# Altium schematic sheet schema.SchDoc
size A3; SheetNumber: 1; SheetTotal: 1
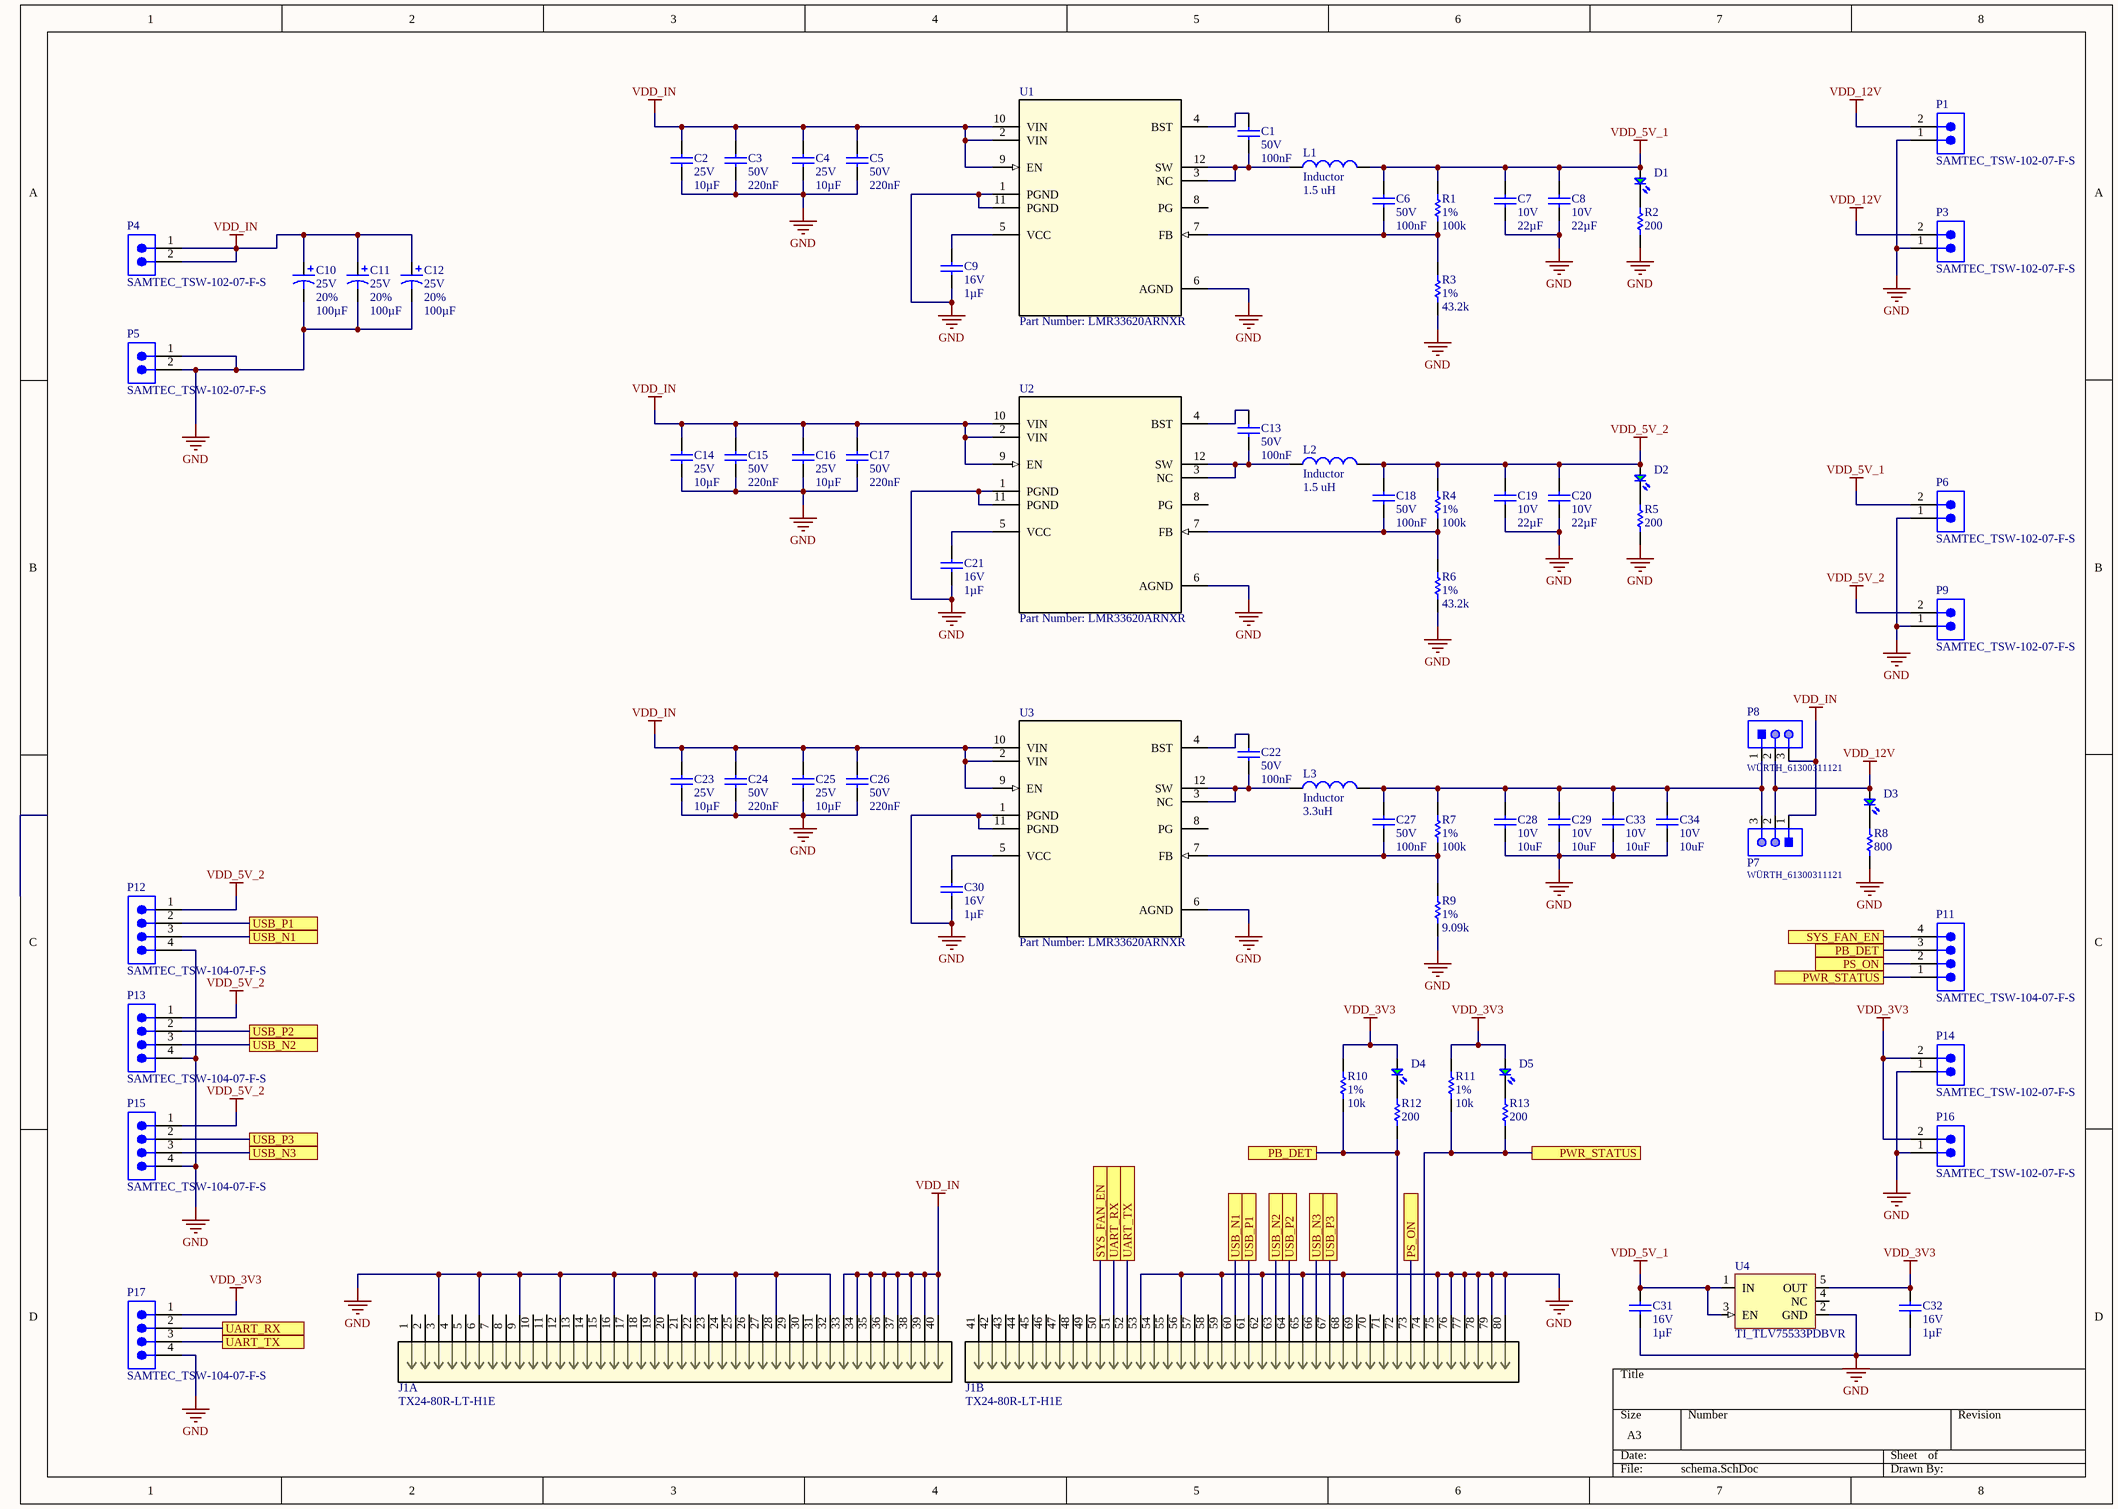
[diagram p0: schema.SchDoc]

## Parts
C1  Voltage Rating: 50V  Component Value: 100nF  [C0402N]  (hidden comment: CAP MLCC 100nF 0402 10% 50V X5R)
C2  Voltage Rating: 25V  Component Value: 10µF  [C0805N]  (hidden comment: CAP MLCC 10uF 0805 10% 25V X5R)
C3  Voltage Rating: 50V  Component Value: 220nF  [C0402N]  (hidden comment: CAP MLCC 100nF 0402 10% 50V X5R)
C4  Voltage Rating: 25V  Component Value: 10µF  [C0805N]  (hidden comment: CAP MLCC 10uF 0805 10% 25V X5R)
C5  Voltage Rating: 50V  Component Value: 220nF  [C0402N]  (hidden comment: CAP MLCC 100nF 0402 10% 50V X5R)
C6  Voltage Rating: 50V  Component Value: 100nF  [C0402N]  (hidden comment: CAP MLCC 100nF 0402 10% 50V X5R)
C7  Voltage Rating: 10V  Component Value: 22µF  [C0805N]  (hidden comment: CAP MLCC 22uF 0805 10% 10V X5R)
C8  Voltage Rating: 10V  Component Value: 22µF  [C0805N]  (hidden comment: CAP MLCC 22uF 0805 10% 10V X5R)
C9  Voltage Rating: 16V  Component Value: 1µF  [C0402N]  (hidden comment: CAP MLCC 1uF 0402 10% 16V X5R)
C10  Voltage Rating: 25V  Component Tolerance: 20%  Component Value: 100µF  [New footprint 1]  (hidden comment: ECAP 100uF radial 20% 25V 0.7mohm)
C11  Voltage Rating: 25V  Component Tolerance: 20%  Component Value: 100µF  [New footprint 1]  (hidden comment: ECAP 100uF radial 20% 25V 0.7mohm)
C12  Voltage Rating: 25V  Component Tolerance: 20%  Component Value: 100µF  [New footprint 1]  (hidden comment: ECAP 100uF radial 20% 25V 0.7mohm)
C13  Voltage Rating: 50V  Component Value: 100nF  [C0402N]  (hidden comment: CAP MLCC 100nF 0402 10% 50V X5R)
C14  Voltage Rating: 25V  Component Value: 10µF  [C0805N]  (hidden comment: CAP MLCC 10uF 0805 10% 25V X5R)
C15  Voltage Rating: 50V  Component Value: 220nF  [C0402N]  (hidden comment: CAP MLCC 100nF 0402 10% 50V X5R)
C16  Voltage Rating: 25V  Component Value: 10µF  [C0805N]  (hidden comment: CAP MLCC 10uF 0805 10% 25V X5R)
C17  Voltage Rating: 50V  Component Value: 220nF  [C0402N]  (hidden comment: CAP MLCC 100nF 0402 10% 50V X5R)
C18  Voltage Rating: 50V  Component Value: 100nF  [C0402N]  (hidden comment: CAP MLCC 100nF 0402 10% 50V X5R)
C19  Voltage Rating: 10V  Component Value: 22µF  [C0805N]  (hidden comment: CAP MLCC 22uF 0805 10% 10V X5R)
C20  Voltage Rating: 10V  Component Value: 22µF  [C0805N]  (hidden comment: CAP MLCC 22uF 0805 10% 10V X5R)
C21  Voltage Rating: 16V  Component Value: 1µF  [C0402N]  (hidden comment: CAP MLCC 1uF 0402 10% 16V X5R)
C22  Voltage Rating: 50V  Component Value: 100nF  [C0402N]  (hidden comment: CAP MLCC 100nF 0402 10% 50V X5R)
C23  Voltage Rating: 25V  Component Value: 10µF  [C0805N]  (hidden comment: CAP MLCC 10uF 0805 10% 25V X5R)
C24  Voltage Rating: 50V  Component Value: 220nF  [C0402N]  (hidden comment: CAP MLCC 100nF 0402 10% 50V X5R)
C25  Voltage Rating: 25V  Component Value: 10µF  [C0805N]  (hidden comment: CAP MLCC 10uF 0805 10% 25V X5R)
C26  Voltage Rating: 50V  Component Value: 220nF  [C0402N]  (hidden comment: CAP MLCC 100nF 0402 10% 50V X5R)
C27  Voltage Rating: 50V  Component Value: 100nF  [C0402N]  (hidden comment: CAP MLCC 100nF 0402 10% 50V X5R)
C28  Voltage Rating: 10V  Component Value: 10uF  [C0805N]  (hidden comment: CAP MLCC 22uF 0805 10% 10V X5R)
C29  Voltage Rating: 10V  Component Value: 10uF  [C0805N]  (hidden comment: CAP MLCC 22uF 0805 10% 10V X5R)
C30  Voltage Rating: 16V  Component Value: 1µF  [C0402N]  (hidden comment: CAP MLCC 1uF 0402 10% 16V X5R)
C31  Voltage Rating: 16V  Component Value: 1µF  [C0402N]  (hidden comment: CAP MLCC 1uF 0402 10% 16V X5R)
C32  Voltage Rating: 16V  Component Value: 1µF  [C0402N]  (hidden comment: CAP MLCC 1uF 0402 10% 16V X5R)
C33  Voltage Rating: 10V  Component Value: 10uF  [C0805N]  (hidden comment: CAP MLCC 22uF 0805 10% 10V X5R)
C34  Voltage Rating: 10V  Component Value: 10uF  [C0805N]  (hidden comment: CAP MLCC 22uF 0805 10% 10V X5R)
D1  Hongbright_H2214AG72E0Z01  [New footprint 1]  (value not drawn)
D2  Hongbright_H2214AG72E0Z01  [New footprint 1]  (value not drawn)
D3  Hongbright_H2214AG72E0Z01  [New footprint 1]  (value not drawn)
D4  Hongbright_H2214AG72E0Z01  [New footprint 1]  (value not drawn)
D5  Hongbright_H2214AG72E0Z01  [New footprint 1]  (value not drawn)
J1  TX24-80R-LT-H1E  [CON80_2X40_MR_TX24_JAE]  (parts A,B of 2)
L1  Inductor  value 1.5 uH  [INDC2016X10N]
L2  Inductor  value 1.5 uH  [INDC2016X10N]
L3  Inductor  value 3.3uH  [INDC2016X10N]
P1  SAMTEC_TSW-102-07-F-S  [SAMTEC-TSW-102-07-X-S]
P3  SAMTEC_TSW-102-07-F-S  [SAMTEC-TSW-102-07-X-S]
P4  SAMTEC_TSW-102-07-F-S  [SAMTEC-TSW-102-07-X-S]
P5  SAMTEC_TSW-102-07-F-S  [SAMTEC-TSW-102-07-X-S]
P6  SAMTEC_TSW-102-07-F-S  [SAMTEC-TSW-102-07-X-S]
P7  WÜRTH_61300311121  [61300311121]
P8  WÜRTH_61300311121  [61300311121]
P9  SAMTEC_TSW-102-07-F-S  [SAMTEC-TSW-102-07-X-S]
P11  SAMTEC_TSW-104-07-F-S  [SAMTEC-TSW-104-07-X-S]
P12  SAMTEC_TSW-104-07-F-S  [SAMTEC-TSW-104-07-X-S]
P13  SAMTEC_TSW-104-07-F-S  [SAMTEC-TSW-104-07-X-S]
P14  SAMTEC_TSW-102-07-F-S  [SAMTEC-TSW-102-07-X-S]
P15  SAMTEC_TSW-104-07-F-S  [SAMTEC-TSW-104-07-X-S]
P16  SAMTEC_TSW-102-07-F-S  [SAMTEC-TSW-102-07-X-S]
P17  SAMTEC_TSW-104-07-F-S  [SAMTEC-TSW-104-07-X-S]
R1  Component Tolerance: 1%  Component Value: 100k  [R0402N]  (hidden comment: RES 100k 0402 1% 63mW)
R2  Component Value: 200  [R0402N]  (hidden comment: RES 100k 0402 1% 63mW)
R3  Component Tolerance: 1%  Component Value: 43.2k  [R0402N]  (hidden comment: RES 100k 0402 1% 63mW)
R4  Component Tolerance: 1%  Component Value: 100k  [R0402N]  (hidden comment: RES 100k 0402 1% 63mW)
R5  Component Value: 200  [R0402N]  (hidden comment: RES 100k 0402 1% 63mW)
R6  Component Tolerance: 1%  Component Value: 43.2k  [R0402N]  (hidden comment: RES 100k 0402 1% 63mW)
R7  Component Tolerance: 1%  Component Value: 100k  [R0402N]  (hidden comment: RES 100k 0402 1% 63mW)
R8  Component Value: 800  [R0402N]  (hidden comment: RES 100k 0402 1% 63mW)
R9  Component Tolerance: 1%  Component Value: 9.09k  [R0402N]  (hidden comment: RES 100k 0402 1% 63mW)
R10  Component Tolerance: 1%  Component Value: 10k  [R0402N]  (hidden comment: RES 100k 0402 1% 63mW)
R11  Component Tolerance: 1%  Component Value: 10k  [R0402N]  (hidden comment: RES 100k 0402 1% 63mW)
R12  Component Value: 200  [R0402N]  (hidden comment: RES 100k 0402 1% 63mW)
R13  Component Value: 200  [R0402N]  (hidden comment: RES 100k 0402 1% 63mW)
U1  Part Number: LMR33620ARNXR  [RNX12]
U2  Part Number: LMR33620ARNXR  [RNX12]
U3  Part Number: LMR33620ARNXR  [RNX12]
U4  TI_TLV75533PDBVR  [SOT23-5P95_280X145L45X40N]

## Ports
PB_DET, PS_ON, PWR_STATUS, SYS_FAN_EN, UART_RX, UART_TX, USB_N1, USB_N2, USB_N3, USB_P1, USB_P2, USB_P3

## Nets
GND: C2.1 C3.1 C4.1 C5.1 C7.1 C8.1 C9.1 C10.2 C11.2 C12.2 C14.1 C15.1 C16.1 C17.1 C19.1 C20.1 C21.1 C23.1 C24.1 C25.1 C26.1 C28.1 C29.1 C30.1 C31.1 C32.1 C33.1 C34.1 J1.3 J1.6 J1.9 J1.12 J1.16 J1.19 J1.22 J1.25 J1.28 J1.32 J1.53 J1.56 J1.59 J1.62 J1.65 J1.68 J1.75 J1.76 J1.77 J1.78 J1.79 J1.80 P1.1 P3.1 P5.1 P5.2 P6.1 P9.1 P12.4 P13.4 P14.1 P15.4 P16.1 P17.4 R2.1 R3.1 R5.1 R6.1 R8.1 R9.1 U1.1(PGND) U1.6(AGND) U1.11(PGND) U2.1(PGND) U2.6(AGND) U2.11(PGND) U3.1(PGND) U3.6(AGND) U3.11(PGND) U4.2(GND)
VDD_3V3: C32.2 D4.1(+) D5.1(+) P14.2 P16.2 P17.1 R10.2 R11.2 U4.5(OUT)
VDD_5V_1: C6.2 C7.2 C8.2 C31.2 D1.1(+) L1.2 P6.2 R1.2 U4.1(IN) U4.3(EN)
VDD_5V_2: C18.2 C19.2 C20.2 D2.1(+) L2.2 P9.2 P12.1 P13.1 P15.1 R4.2
VDD_12V: D3.1(+) P1.2 P3.2 P7.2 P8.2
VDD_IN: C2.2 C3.2 C4.2 C5.2 C10.1 C11.1 C12.1 C14.2 C15.2 C16.2 C17.2 C23.2 C24.2 C25.2 C26.2 J1.33 J1.34 J1.35 J1.36 J1.37 J1.38 J1.39 J1.40 P4.1 P4.2 P7.1 P8.3 U1.2(VIN) U1.9(EN) U1.10(VIN) U2.2(VIN) U2.9(EN) U2.10(VIN) U3.2(VIN) U3.9(EN) U3.10(VIN)
PB_DET: J1.72 P11.3 R10.1 R12.1 ; port PB_DET
PS_ON: J1.73 P11.2 ; port PS_ON
PWR_STATUS: J1.74 P11.1 R11.1 R13.1 ; port PWR_STATUS
SYS_FAN_EN: J1.50 P11.4 ; port SYS_FAN_EN
UART_RX: J1.51 P17.2 ; port UART_RX
UART_TX: J1.52 P17.3 ; port UART_TX
USB_N1: J1.60 P12.3 ; port USB_N1
USB_N2: J1.63 P13.3 ; port USB_N2
USB_N3: J1.66 P15.3 ; port USB_N3
USB_P1: J1.61 P12.2 ; port USB_P1
USB_P2: J1.64 P13.2 ; port USB_P2
USB_P3: J1.67 P15.2 ; port USB_P3
NetC1_1: C1.1 L1.1 U1.3(NC) U1.12(SW)
NetC1_2: C1.2 U1.4(BST)
NetC6_1: C6.1 R1.1 R3.2 U1.7(FB)
NetC9_2: C9.2 U1.5(VCC)
NetC13_1: C13.1 L2.1 U2.3(NC) U2.12(SW)
NetC13_2: C13.2 U2.4(BST)
NetC18_1: C18.1 R4.1 R6.2 U2.7(FB)
NetC21_2: C21.2 U2.5(VCC)
NetC22_1: C22.1 L3.1 U3.3(NC) U3.12(SW)
NetC22_2: C22.2 U3.4(BST)
NetC27_1: C27.1 R7.1 R9.2 U3.7(FB)
NetC27_2: C27.2 C28.2 C29.2 C33.2 C34.2 L3.2 P7.3 P8.1 R7.2
NetC30_2: C30.2 U3.5(VCC)
NetD1_2: D1.2(-) R2.2
NetD2_2: D2.2(-) R5.2
NetD3_2: D3.2(-) R8.2
NetD4_2: D4.2(-) R12.2
NetD5_2: D5.2(-) R13.2

Not connected (* = marked no-connect by the designer): J1 1 2 4 5 7 8 10 11 13 14 15 17 18 20 21 23 24 26 27 29 30 31 41 42 43 44 45 46 47 48 49 54 55 57 58 69 70 71; U1 8(PG); U2 8(PG); U3 8(PG); U4 4(NC)

## Library data of the parts
C1 C3 C5 C6 C13 C15 C17 C18 C22 C24 C26 C27 = CMP-02799-2: Capacitor, MLCC, 100nF, 0402, 10%, 50V, X5R; TC ID: 50021748; Dielectric: X5R; Component Tolerance: 10%; Package: 0402; Operating Temperature (°C): -55 to +85
C2 C4 C14 C16 C23 C25 = CMP-02808-3: Capacitor, MLCC, 10uF, 0805, 10%, 25V, X5R; TC ID: 50016549; Dielectric: X5R; Component Tolerance: 10%; Operating Temperature (°C): -55 to +85; Package: 0805
C7 C8 C19 C20 C28 C29 C33 C34 = CMP-02864-4: Capacitor, MLCC, 22uF, 0805, 10%, 10V, X5R; TC ID: 50024017; Dielectric: X5R; Component Tolerance: 10%; Operating Temperature (°C): -55 to +85; Package: 0805
C9 C21 C30-C32 = CMP-02807-3: Capacitor, MLCC, 1uF, 0402, 10%, 16V, X5R; TC ID: 50021750; Dielectric: X5R; Component Tolerance: 10%; Operating Temperature (°C): -55 to +125; Package: 0402
C10-C12 = CMP-02868-3: Electrolytic capacitor, 100uF, radial, 20%, 25V, 0.7mohm; Manufacturer Part Number 1: 25TRV100M6.3X8; Manufacturer 1: Rubycon; TC ID: 50020370; Datasheet: http://www.rubycon.co.jp/en/catalog/e_pdfs/aluminum/e_TRV.pdf; Operating Temperature (°C): -40 to +105
D1-D5 = CMP-004-00012-6: Green LED, VFmax 3.6V; Manufacturer Part Number 1: H2214AG72E0Z01; Manufacturer 1: Hongbright; TC ID: *; Datasheet: *; Operating Temperature (°C): -40 to +100
J1 = TX24-80R-LT-H1E: No Description Available; Vendor: JAE Electronics; Built_By: EMA_UL_Team; SourceLibrary: JAE_2009-02-18; Manufacturer_Part_Number: TX24-80R-LT-H1E; Copyright: Copyright (C) 2018 Accelerated Designs. All rights reserved; RefDes: RefDes; Type: DEV
L1-L3 = Inductor: Code_IEC: 1005; Published: 8-Jun-2000; LatestRevisionDate: 29-May-2009; LatestRevisionNote: IPC-7351 Footprint Added.; PackageReference: 0402-A; Publisher: Altium Limited; PackageDescription: Chip Inductor; Code_JEITA: 0402
P1 P3-P6 P9 P14 P16 = CMP-03065-1: CONN HEADER VERT 2POS 2.54MM; Manufacturer 1: Samtec Inc.; TC ID: 50025272; Operating Temperature (°C): -55 to +125; Datasheet: http://suddendocs.samtec.com/catalog_english/tsw_th.pdf; Manufacturer Part Number 1: TSW-102-07-F-S
P7 P8 = CMP-018-0014-3: Board Connector, 3 Contact(s), 1 Row(s), Male, Straight, 0.1 inch Pitch, Solder Terminal, Locking, Black Insulator, Plug; Manufacturer 1: Würth; TC ID: *; Manufacturer Part Number 1: 61300311121; Datasheet: *; Operating Temperature (°C): -40 to +125
P11-P13 P15 P17 = CMP-03066-1: CONN HEADER VERT 4POS 2.54MM; Manufacturer 1: Samtec Inc.; TC ID: 50025274; Manufacturer Part Number 1: TSW-104-07-F-S; Operating Temperature (°C): -55 to +125; Datasheet: http://suddendocs.samtec.com/catalog_english/tsw_th.pdf
R1-R13 = CMP-02821-5: Resistor, 100k, 0402, 1%, 63mW; TC ID: 50020637; Power Rating: 63mW; Operating Temperature (°C): -55 to +125; Package: 0402
  R2 R5 R8 R12 R13: Component Tolerance: 1%
U1-U3 = LMR33620: SIMPLE SWITCHER® 3.8V to 36V, 2A Synchronous Buck Converter With Ultra-Low EMI; Manufacturer: Texas Instruments; PartNumber: LMR33620ARNXR; RefDes: RefDes; TYPE: TYPE; Value: Value
U4 = CMP-02789-4: Fixed Positive LDO Regulator, 3.3V, 0.238V Dropout, PDSO5; Manufacturer 1: Texas Instruments; TC ID: 50021849; Package: SOT-23-5; Operating Temperature (°C): -40 to +125; Manufacturer Part Number 1: TLV75533PDBVR; Datasheet: *